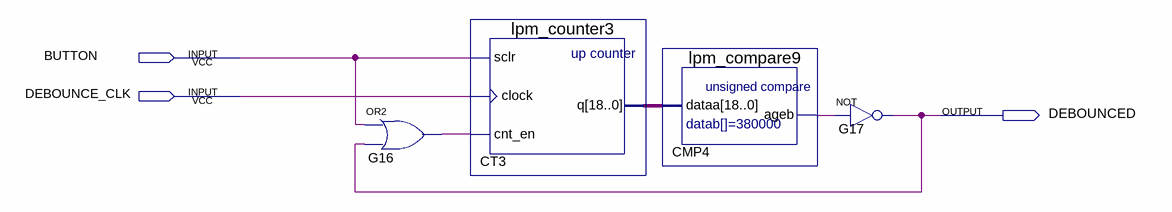
[diagram p0: schematic sheet]
// Quartus schematic debouncer.bdf as structural Verilog: 4 symbols, 3 pins
module debouncer (
  input  BUTTON,
  input  DEBOUNCE_CLK,
  output DEBOUNCED
);

  wire CMP4_ageb, G16_out;
  wire [18:0] CT3_q;

  or G16 (G16_out, BUTTON, DEBOUNCED);
  lpm_counter3 CT3 (.sclr(BUTTON), .clock(DEBOUNCE_CLK), .cnt_en(G16_out), .q(CT3_q));
  lpm_compare9 CMP4 (.dataa(CT3_q), .ageb(CMP4_ageb));
  not G17 (DEBOUNCED, CMP4_ageb);
endmodule
